# Altium project MY26 HV Inverter Logic Board.PrjPcb (part 2 of 3)

## Sheet Connector.SchDoc
size A; SheetNumber: 6; SheetTotal: 15
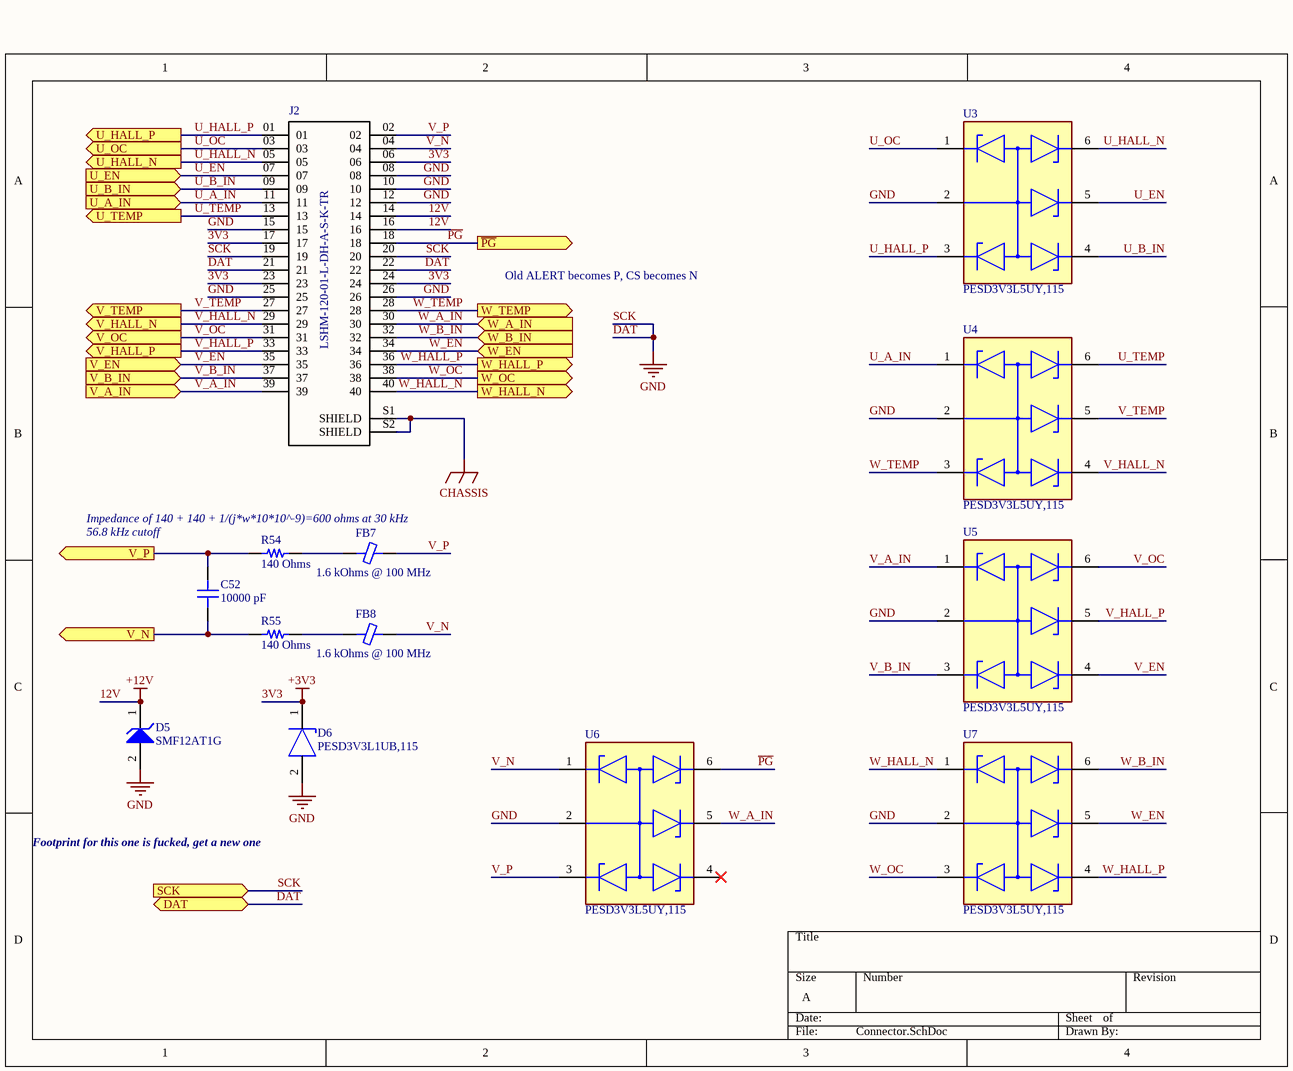
[diagram p4: Connector.SchDoc]

### Parts
C52  10000 pF  [CAP 0402_1005]
D5  SMF12AT1G  [ONSC-SOD-123FL-2-498_V]
D6  PESD3V3L1UB,115  [FP-SOD523-MFG]
FB7  1.6 kOhms @ 100 MHz  [FER 0603_1608]
FB8  1.6 kOhms @ 100 MHz  [FER 0603_1608]
J2  LSHM-120-01-L-DH-A-S-K-TR  [*SAMTEC_LSHM-120-01-L-DH-A-S-K-TR_LSHM-120-01-L-DH-A-S-K-TR(Primary)]
R54  140 Ohms  [RES 0402_1005]
R55  140 Ohms  [RES 0402_1005]
U3  PESD3V3L5UY,115  [FP-SOT363-IPC_A]
U4  PESD3V3L5UY,115  [FP-SOT363-IPC_A]
U5  PESD3V3L5UY,115  [FP-SOT363-IPC_A]
U6  PESD3V3L5UY,115  [FP-SOT363-IPC_A]
U7  PESD3V3L5UY,115  [FP-SOT363-IPC_A]

### Ports
DAT (bidir), SCK (in), U_A_IN (in), U_B_IN (in), U_EN (in), U_HALL_N (out), U_HALL_P (out), U_OC (out), U_TEMP (out), V_A_IN (in), V_B_IN (in), V_EN (in), V_HALL_N (out), V_HALL_P (out), V_N (out), V_OC (out), V_P (out), V_TEMP (out), W_A_IN (in), W_B_IN (in), W_EN (in), W_HALL_N (out), W_HALL_P (out), W_OC (out), W_TEMP (out), ~{PG} (out)

### Nets
+3V3: D6.1(C) J2.06 J2.17 J2.23 J2.24  [also labelled 3V3]
+12V: D5.1(K) J2.14 J2.16  [also labelled 12V]
CHASSIS: J2.S1(SHIELD) J2.S2(SHIELD)
GND: D5.2(A) D6.2(A) J2.08 J2.10 J2.12 J2.15 J2.19 J2.20 J2.21 J2.22 J2.25 J2.26 U3.2(COMMON_ANODE) U4.2(COMMON_ANODE) U5.2(COMMON_ANODE) U6.2(COMMON_ANODE) U7.2(COMMON_ANODE) ; port SCK, port DAT  [also labelled DAT, SCK]
~{PG}: J2.18 U6.6(CATHODE(DIODE_5)) ; port ~{PG}
U_A_IN: J2.11 U4.1(CATHODE(DIODE_1)) ; port U_A_IN
U_B_IN: J2.09 U3.4(CATHODE(DIODE_3)) ; port U_B_IN
U_EN: J2.07 J2.34 J2.35 U3.5(CATHODE(DIODE_4)) U5.4(CATHODE(DIODE_3)) U7.5(CATHODE(DIODE_4)) ; port U_EN, port V_EN, port W_EN  [also labelled V_EN, W_EN]
U_HALL_N: J2.05 U3.6(CATHODE(DIODE_5)) ; port U_HALL_N
U_HALL_P: J2.01 U3.3(CATHODE(DIODE_2)) ; port U_HALL_P
U_OC: J2.03 U3.1(CATHODE(DIODE_1)) ; port U_OC
U_TEMP: J2.13 U4.6(CATHODE(DIODE_5)) ; port U_TEMP
V_A_IN: J2.39 U5.1(CATHODE(DIODE_1)) ; port V_A_IN
V_B_IN: J2.37 U5.3(CATHODE(DIODE_2)) ; port V_B_IN
V_HALL_N: J2.29 U4.4(CATHODE(DIODE_3)) ; port V_HALL_N
V_HALL_P: J2.33 U5.5(CATHODE(DIODE_4)) ; port V_HALL_P
V_N: FB8.2 J2.04 U6.1(CATHODE(DIODE_1))  [project net V_N_6]
V_OC: J2.31 U5.6(CATHODE(DIODE_5)) ; port V_OC
V_P: FB7.2 J2.02 U6.3(CATHODE(DIODE_2))  [project net V_P_6]
V_SENSE_N: C52.1 R55.1 ; port V_N
V_SENSE_P: C52.2 R54.1 ; port V_P
V_TEMP: J2.27 U4.5(CATHODE(DIODE_4)) ; port V_TEMP
W_A_IN: J2.30 U6.5(CATHODE(DIODE_4)) ; port W_A_IN
W_B_IN: J2.32 U7.6(CATHODE(DIODE_5)) ; port W_B_IN
W_HALL_N: J2.40 U7.1(CATHODE(DIODE_1)) ; port W_HALL_N
W_HALL_P: J2.36 U7.4(CATHODE(DIODE_3)) ; port W_HALL_P
W_OC: J2.38 U7.3(CATHODE(DIODE_2)) ; port W_OC
W_TEMP: J2.28 U4.3(CATHODE(DIODE_2)) ; port W_TEMP
NetFB7_1: FB7.1 R54.2
NetFB8_1: FB8.1 R55.2

Not connected (* = marked no-connect by the designer): U6 4(CATHODE(DIODE_3))*

### Notes on the sheet
- Old ALERT becomes P, CS becomes N
- (near C52) 56.8 kHz cutoff
- Impedance of 140 + 140 + 1/(j*w*10*10^-9)=600 ohms at 30 kHz
- Footprint for this one is fucked, get a new one

### Library data of the parts
C52 = C0402C103J5RECAUTO: CAP CER 0402 10NF 50V X7R 5%; manufacturer: KEMET; Part Number: C0402C103J5RECAUTO; Capacitance: 10000 pF; Applications: Automotive, ESD Protection; componentlink1description: Datasheet; componentlink1url: https://api.kemet.com/component-edge/download/datasheet/C0402C103J5RECAUTO.pdf; componentlink2description: DigiKey Link; componentlink2url: https://www.digikey.com/en/products/detail/kemet/C0402C103J5RECAUTO/8646448; Device Package: 0402 (1005 Metric); lastupdated: 2/9/2024 8:04:13 PM; Lifecycle Status: Active; Minimum Order: 1; Mounting Type: Surface Mount, MLCC; Operating Temperature: -55°C ~ 125°C; Package / Case: 0402 (1005 Metric); packaging: TapeAndReel; partid: 33153; Part Status: Active; price: 0.02; Ratings: AEC-Q200; series: ESD SMD Auto X7R; Size / Dimension: 0.039" L x 0.020" W (1.00mm x 0.50mm); Supplier 1: DigiKey; Supplier Part Number 1: 399-C0402C103J5RECAUTOCT-ND; Temperature Coefficient: X7R; Thickness (Max): 0.022" (0.55mm); Tolerance: ±5%; value: 10000 pF; Voltage - Rated: 50V
D5 = CMP-1061-00626-1: 200 W Transient Voltage Suppressor, 2-Pin SOD-123FL, Pb-Free, Tape and Reel; Manufacturer: On Semiconductor; Direction: Unidirectional; V(BR) Typ (V): 14; IR Max (uA): 2.5; PackageDescription: 2-Pin SOD, Body 1.65 x 2.7 mm; ComponentLink2URL: http://www.onsemi.com/pub_link/Collateral/SMF5.0AT1-D.PDF; DatasheetVersion: Rev. 7; PartNumber: SMF12AT1G; ComponentLink1Description: Manufacturer URL; ComponentLink2Description: Datasheet; ComponentLink1URL: http://www.onsemi.com/; ComponentLink3Description: Package Specification; Mounting Technology: Surface Mount; PackageReference: SOD-123FL-2-498; RoHS: Pb-Free; PackageVersion: Rev. D, 05/2013; Packing: Tape and Reel; ComponentLink3URL: http://www.onsemi.com/pub_link/Collateral/498-01.PDF
D6 = CMP-14432-000009-1: TVS DIODE 3.3VWM 11VC SOD523; RoHS Compliant: Yes
FB7 FB8 = MHF1608BAC352ATD25: FERRITE BEAD 1.6K OHM 0603 1LN; Manufacturer: TDK Corporation; Current Rating (Max): 170mA; DC Resistance (DCR) (Max): 1.8Ohm; Number of Lines: 1; Part Number: MHF1608BAC352ATD25; ComponentLink1Description: Datasheet; ComponentLink1URL: https://media.digikey.com/pdf/Data%20Sheets/TDK%20PDFs/MHF1608_Type_DS.pdf; ComponentLink2Description: DigiKey Link; ComponentLink2URL: https://www.digikey.com/en/products/detail/tdk-corporation/MHF1608BAC352ATD25/12702586; Device Package: 0603 (1608 Metric); Height (Max): 0.037" (0.95mm); Impedance @ Frequency: 1.6 kOhms @ 100 MHz; LastUpdated: 6/3/2024 7:51:46 PM; Lifecycle Status: Active; Minimum Order: 1; Mounting Type: Surface Mount; Operating Temperature: -55°C ~ 125°C; Package / Case: 0603 (1608 Metric); Packaging: TapeAndReel; PartId: 2238; Part Status: Active; Price: 0.05; Ratings: AEC-Q200; Series: MHF; Size / Dimension: 0.063" L x 0.031" W (1.60mm x 0.80mm); Supplier 1: DigiKey; Supplier Part Number 1: 445-MHF1608BAC352ATD25CT-ND; Value: 1.6 kOhms @ 100 MHz
R54 R55 = RQ73C1E140RBTD: RES 140 OHMS 0.1% 1/16W 0402; Manufacturer: TE Connectivity Passive Product; Power (Watts): 0.063W, 1/16W; Temperature Coefficient: ±10ppm/°C; Part Number: RQ73C1E140RBTD; Value: 140 Ohms; ComponentLink1Description: Datasheet; ComponentLink1URL: //media.digikey.com/pdf/Data%20Sheets/Tyco%20Electronics%20P%20B%20PDFs/RQ73-0618%20v2.pdf; ComponentLink2Description: DigiKey Link; ComponentLink2URL: https://www.digikey.com/en/products/detail/te-connectivity-passive-product/RQ73C1E140RBTD/9480200; Composition: Thin Film; Device Package: 0402 (1005 Metric); Features: Anti-Sulfur, Automotive AEC-Q200; Height - Seated (Max): 0.016" (0.40mm); LastUpdated: 2/9/2024 8:30:21 PM; Lifecycle Status: Active; Minimum Order: 1; Number of Terminations: 2; Operating Temperature: -55°C ~ 155°C; Package / Case: 0402 (1005 Metric); Packaging: TapeAndReel; PartId: 3032; Part Status: Active; Price: 0.27; Ratings: AEC-Q200; Resistance: 140 Ohms; Series: RQ73; Size / Dimension: 0.039" L x 0.020" W (1.00mm x 0.50mm); Supplier 1: DigiKey; Supplier Part Number 1: A140252CT-ND; Supplier Device Package: 0402; Tolerance: ±0.1%
U3-U7 = CMP-14432-000006-1: TVS DIODE 3.3VWM 12VC 6TSSOP; RoHS Compliant: Yes
J2 = LSHM-120-01-L-DH-A-S-K-TR: Value: *

## Sheet SDMMC.SchDoc
size A; SheetNumber: 7; SheetTotal: 15
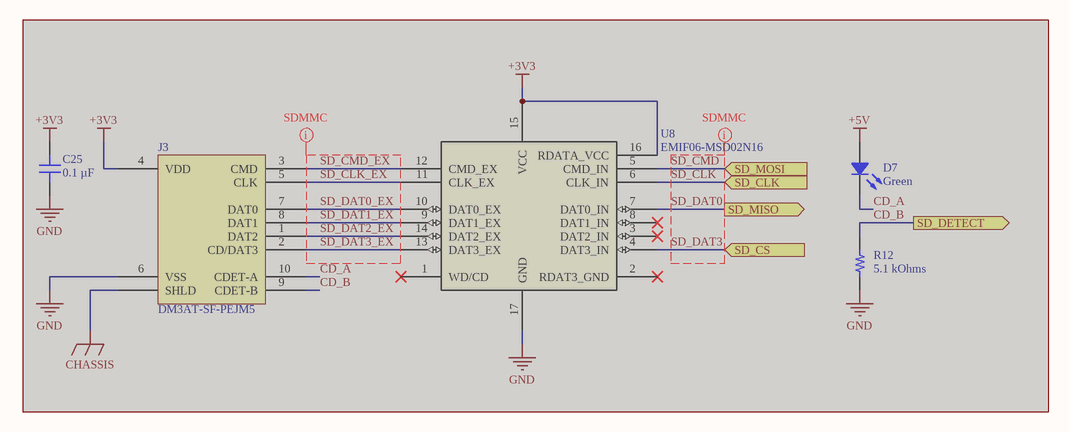
[diagram p5: SDMMC.SchDoc]

### Parts
(Parts that share a designator on the sheet are numbered #1, #2 ... from top to bottom, then left to right.)
C25#2  0.1 µF  [CAP 0402_1005]  (masked out: inside a compile mask, not in the netlist)
D7  Green  [LED 0603_1608 GREEN]  (masked out: inside a compile mask, not in the netlist)
J3#2  DM3AT-SF-PEJM5  [HIROSE DM3AT-SF-PEJM5]  (masked out: inside a compile mask, not in the netlist)
R12#2  5.1 kOhms  [RES 0603_1608]  (masked out: inside a compile mask, not in the netlist)
U8  EMIF06-MSD02N16  [EMIF06MSD02N16]  (masked out: inside a compile mask, not in the netlist)

### Ports
SD_CLK (in), SD_CS (in), SD_DETECT (out), SD_MISO (out), SD_MOSI (in)

### Layout directives
net class SDMMC: SD_CLK, SD_CLK_EX, SD_CMD, SD_CMD_EX, SD_DAT0, SD_DAT0_EX, SD_DAT1_EX, SD_DAT2_EX, SD_DAT3, SD_DAT3_EX

### Library data of the parts
C25#2 = C0402C104K4RECAUTO: CAP CER 0402 0.1UF 16V X7R 10%; manufacturer: KEMET; Part Number: C0402C104K4RECAUTO; Capacitance: 0.1 µF; Applications: Automotive, ESD Protection; componentlink1description: Datasheet; componentlink1url: https://api.kemet.com/component-edge/download/datasheet/C0402C104K4RECAUTO.pdf; componentlink2description: DigiKey Link; componentlink2url: https://www.digikey.com/en/products/detail/kemet/C0402C104K4RECAUTO/8563695; Device Package: 0402 (1005 Metric); lastupdated: 2/9/2024 8:04:38 PM; Lifecycle Status: Active; Minimum Order: 1; Mounting Type: Surface Mount, MLCC; Operating Temperature: -55°C ~ 125°C; Package / Case: 0402 (1005 Metric); packaging: TapeAndReel; partid: 1731; Part Status: Active; price: 0.01; Ratings: AEC-Q200; series: ESD SMD Auto X7R; Size / Dimension: 0.039" L x 0.020" W (1.00mm x 0.50mm); Supplier 1: DigiKey; Supplier Part Number 1: 399-17167-1-ND; Temperature Coefficient: X7R; Thickness (Max): 0.022" (0.55mm); Tolerance: ±10%; value: 0.1 µF; Voltage - Rated: 16V
D7 = SECU1413C-TG20: GREEN, D=564NM, IV=75MCD; Manufacturer: Sanken; Current - Test: 20mA; Lens Size: 0.92mm Dia; Lens Style: Round with Domed Top; Millicandela Rating: 75mcd; Viewing Angle: 60°; Voltage - Forward (Vf) (Typ): 2.1V; Wavelength - Dominant: 564nm; Part Number: SECU1413C-TG20; Color: Green; ComponentLink1Description: Datasheet; ComponentLink1URL: https://www.semicon.sanken-ele.co.jp/sk_content/secu1413c-tg20_ds_en.pdf; ComponentLink2Description: DigiKey Link; ComponentLink2URL: https://www.digikey.com/en/products/detail/sanken/SECU1413C-TG20/16639358; Device Package: 0603 (1608 Metric); Height (Max): 1.48mm; LastUpdated: 6/3/2024 7:58:48 PM; Lifecycle Status: Active; Minimum Order: 1; Mounting Type: Surface Mount; Package / Case: 0603 (1608 Metric); Packaging: CutTape; PartId: 1166; Part Status: Active; Price: 0.28; Series: -; Size / Dimension: 1.60mm L x 0.80mm W; Supplier 1: DigiKey; Supplier Part Number 1: 1261-SECU1413C-TG20TR-ND; Supplier Device Package: 0603; Value: Green
J3#2 = DM3AT-SF-PEJM5: CONN MICRO SD CARD PUSH-PUSH R/A; Manufacturer: Hirose Electric Co Ltd; Card Type: Secure Digital - microSD™; Connector Type: Connector and Ejector; Insertion, Removal Method: Push In, Push Out; Number of Positions: 10 (8 + 2); Part Number: DM3AT-SF-PEJM5; ComponentLink1Description: Datasheet; ComponentLink1URL: https://www.hirose.com/product/document?clcode=CL0609-0033-6-00&productname=DM3AT-SF-PEJ2M5&series=DM3&documenttype=Catalog&lang=en&documentid=D49662_en; ComponentLink2Description: DigiKey Link; ComponentLink2URL: //digikey.com/product-detail/en/hirose-electric-co-ltd/DM3AT-SF-PEJM5/HR1964TR-ND/2533565; Contact Finish: Gold; Features: Switch; Height Above Board: 0.066" (1.68mm); LastUpdated: 12/16/2019 8:34:40 PM; Lifecycle Status: 0; Minimum Order: 1; Mounting Feature: Normal, Standard - Top; Mounting Type: Surface Mount, Right Angle; Packaging: TapeAndReel; Part Status: Active; Price: 1.41; Series: DM3; Supplier 1: DigiKey; Supplier Part Number 1: HR1964TR-ND
R12#2 = RMCF0603JG5K10: RES 5.1K OHM 5% 1/10W 0603; Manufacturer: Stackpole Electronics Inc; Power (Watts): 0.1W, 1/10W; Temperature Coefficient: ±200ppm/°C; Part Number: RMCF0603JG5K10; Value: 5.1 kOhms; ComponentLink1Description: Datasheet; ComponentLink1URL: https://www.seielect.com/catalog/sei-packaging.pdf; ComponentLink2Description: DigiKey Link; ComponentLink2URL: https://www.digikey.com/en/products/detail/stackpole-electronics-inc/RMCF0603JG5K10/1712287; Composition: Thick Film; Device Package: 0603 (1608 Metric); Features: Automotive AEC-Q200; Height - Seated (Max): 0.022" (0.55mm); LastUpdated: 2/9/2024 8:43:35 PM; Lifecycle Status: Active; Minimum Order: 1; Number of Terminations: 2; Operating Temperature: -55°C ~ 155°C; Package / Case: 0603 (1608 Metric); Packaging: CutTape; PartId: 5180; Part Status: Active; Price: 0.01; Ratings: AEC-Q200; Resistance: 5.1 kOhms; Series: RMCF; Size / Dimension: 0.061" L x 0.031" W (1.55mm x 0.80mm); Supplier 1: DigiKey; Supplier Part Number 1: 738-RMCF0603JG5K10CT-ND; Supplier Device Package: 0603; Tolerance: ±5%
U8 = EMIF06-MSD02N16: No Description Available; Mfr_Name: STMicroelectronics; RefDes: RefDes; Type: Type

## Sheet Power.SchDoc
size A; SheetNumber: 8; SheetTotal: 15
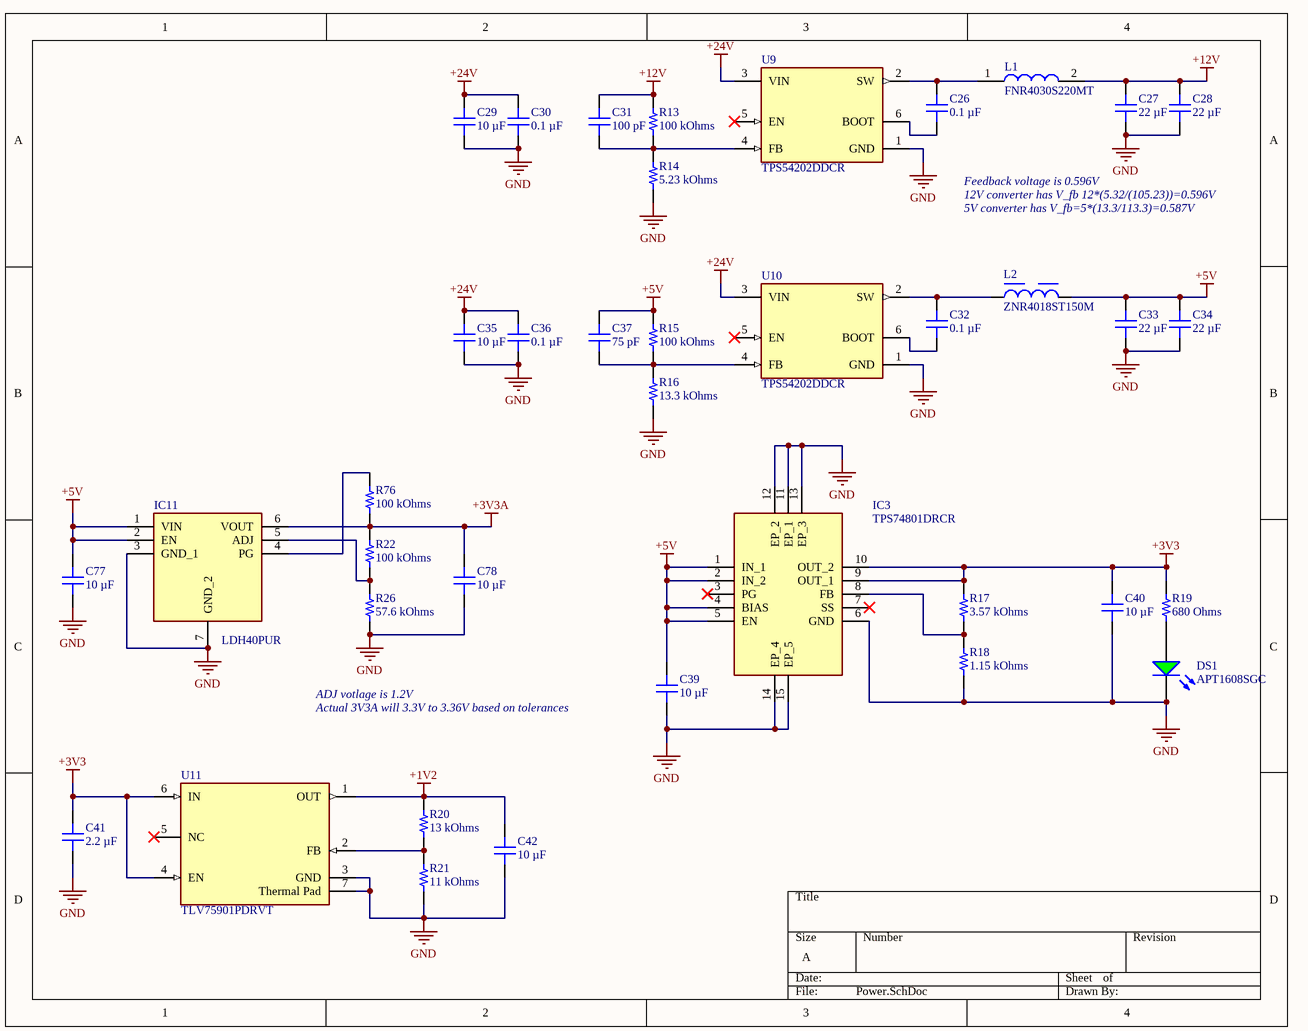
[diagram p6: Power.SchDoc]

### Parts
(Parts that share a designator on the sheet are numbered #1, #2 ... from top to bottom, then left to right.)
C26  0.1 µF  [MURATA GCM155 0402_1005]
C27  22 µF  [CAP 0805_2012]
C28  22 µF  [CAP 0805_2012]
C29  10 µF  [CAP 0805_2012]
C30  0.1 µF  [CAP 0402_1005]
C31  100 pF  [CAP 0402_1005]
C32  0.1 µF  [MURATA GCM155 0402_1005]
C33  22 µF  [CAP 0805_2012]
C34  22 µF  [CAP 0805_2012]
C35  10 µF  [CAP 0805_2012]
C36  0.1 µF  [CAP 0402_1005]
C37  75 pF  [MURATA GCM155 0402_1005]
C39  10 µF  [CAP 0402_1005]
C40  10 µF  [CAP 0402_1005]
C41  2.2 µF  [CAP 0402_1005]
C42  10 µF  [CAP 0402_1005]
C77  10 µF  [CAP 0402_1005]
C78  10 µF  [CAP 0402_1005]
DS1  APT1608SGC  [KING-APT1608SGC_V]
IC3  TPS74801DRCR  [TPS74801DRCR]
IC11  LDH40PUR  [SON65P200X200X80-7N]
L1  FNR4030S220MT  [VLCF4020]
L2  ZNR4018ST150M  [WE-LQS_4025]
R13  100 kOhms  [RES 0402_1005]
R14  5.23 kOhms  [RES 0402_1005]
R15  100 kOhms  [RES 0402_1005]
R16  13.3 kOhms  [YAGEO RES 0402_1005]
R17  3.57 kOhms  [YAGEO RES 0402_1005]
R18  1.15 kOhms  [RES 0402_1005]
R19  680 Ohms  [YAGEO RES 0402_1005]
R20  13 kOhms  [YAGEO RES 0402_1005]
R21  11 kOhms  [RES 0402_1005]
R22  100 kOhms  [RES 0402_1005]
R26#1  57.6 kOhms  [RES 0402_1005]
R76  100 kOhms  [RES 0402_1005]
U9  TPS54202DDCR  [FP-DDC0006A-IPC_B]
U10  TPS54202DDCR  [FP-DDC0006A-IPC_B]
U11  TLV75901PDRVT  [FP-DRV0006A-IPC_B]

### Nets
+1V2: C42.2 R20.2 U11.1(OUT)
+3V3: C40.2 C41.2 IC3.9(OUT_1) IC3.10(OUT_2) R17.2 R19.2 U11.4(EN) U11.6(IN)
+3V3A: C78.2 IC11.6(VOUT) R22.2 R76.1
+5V: C33.2 C34.2 C37.2 C39.2 C77.2 IC3.1(IN_1) IC3.2(IN_2) IC3.4(BIAS) IC3.5(EN) IC11.1(VIN) IC11.2(EN) L2.2 R15.2
+12V: C27.2 C28.2 C31.2 L1.2 R13.2
+24V: C29.2 C30.2 C35.2 C36.2 U9.3(VIN) U10.3(VIN)
GND: C27.1 C28.1 C29.1 C30.1 C33.1 C34.1 C35.1 C36.1 C39.1 C40.1 C41.1 C42.1 C77.1 C78.1 DS1.2(K) IC3.6(GND) IC3.11(EP_1) IC3.12(EP_2) IC3.13(EP_3) IC3.14(EP_4) IC3.15(EP_5) IC11.3(GND_1) IC11.7(GND_2) R14.1 R16.1 R18.1 R21.1 R26#1.1 U9.1(GND) U10.1(GND) U11.3(GND) U11.7(Thermal_Pad)
NetC26_1: C26.1 U9.6(BOOT)
NetC26_2: C26.2 L1.1 U9.2(SW)
NetC31_1: C31.1 R13.1 R14.2 U9.4(FB)
NetC32_1: C32.1 U10.6(BOOT)
NetC32_2: C32.2 L2.1 U10.2(SW)
NetC37_1: C37.1 R15.1 R16.2 U10.4(FB)
NetDS1_1: DS1.1(A) R19.1
NetIC3_8: IC3.8(FB) R17.1 R18.2
NetIC11_4: IC11.4(PG) R76.2
NetIC11_5: IC11.5(ADJ) R22.1 R26#1.2
NetR20_1: R20.1 R21.2 U11.2(FB)

Not connected (* = marked no-connect by the designer): IC3 3(PG)* 7(SS)*; U9 5(EN)*; U10 5(EN)*; U11 5(NC)*

### Notes on the sheet
- Feedback voltage is 0.596V
- 12V converter has V_fb 12*(5.32/(105.23))=0.596V
- 5V converter has V_fb=5*(13.3/113.3)=0.587V
- ADJ votlage is 1.2V
- (near C39) Actual 3V3A will 3.3V to 3.36V based on tolerances

### Library data of the parts
C26 C32 = GCM155R71E104KE02D: CAP CER 0.1UF 25V X7R 0402; manufacturer: Murata Electronics; Tolerance: ±10%; Part Number: GCM155R71E104KE02D; Capacitance: 0.1 µF; Applications: Automotive; componentlink1description: Datasheet; componentlink1url: https://search.murata.co.jp/Ceramy/image/img/A01X/G101/ENG/GCM155R71E104KE02-01.pdf; componentlink2description: DigiKey Link; componentlink2url: https://www.digikey.com/en/products/detail/murata-electronics/GCM155R71E104KE02D/7363175; Device Package: 0402 (1005 Metric); lastupdated: 7/20/2024 2:04:19 AM; Lifecycle Status: Active; Minimum Order: 1; Mounting Type: Surface Mount, MLCC; Operating Temperature: -55°C ~ 125°C; Package / Case: 0402 (1005 Metric); packaging: TapeAndReel; partid: 2051; Part Status: Active; price: 0.01; Ratings: AEC-Q200; series: GCM; Size / Dimension: 0.039" L x 0.020" W (1.00mm x 0.50mm); Supplier 1: DigiKey; Supplier Part Number 1: 490-16431-1-ND; Temperature Coefficient: X7R; Thickness (Max): 0.022" (0.55mm); value: 0.1 µF; Voltage - Rated: 25V
C27 C28 C33 C34 = CL21A226MAYNNNE: CAP CER 22UF 25V X5R 0805; manufacturer: Samsung Electro-Mechanics; Tolerance: ±20%; Part Number: CL21A226MAYNNNE; Capacitance: 22 µF; Applications: General Purpose; componentlink1description: Datasheet; componentlink1url: https://media.digikey.com/pdf/Data%20Sheets/Samsung%20PDFs/CL21A226MAYNNNE_Spec.pdf; componentlink2description: DigiKey Link; componentlink2url: https://www.digikey.com/en/products/detail/samsung-electro-mechanics/CL21A226MAYNNNE/10479857; Device Package: 0805 (2012 Metric); lastupdated: 2/9/2024 8:15:02 PM; Lifecycle Status: Active; Minimum Order: 1; Mounting Type: Surface Mount, MLCC; Operating Temperature: -55°C ~ 85°C; Package / Case: 0805 (2012 Metric); packaging: TapeAndReel; partid: 39209; Part Status: Active; price: 0.04; series: CL; Size / Dimension: 0.079" L x 0.049" W (2.00mm x 1.25mm); Supplier 1: DigiKey; Supplier Part Number 1: 1276-CL21A226MAYNNNECT-ND; Temperature Coefficient: X5R; Thickness (Max): 0.057" (1.45mm); value: 22 µF; Voltage - Rated: 25V
C29 C35 = C0805B106K050T: CAP CER 10UF 50V X5R 0805; manufacturer: Holy Stone Enterprise Co., Ltd.; Tolerance: ±10%; Part Number: C0805B106K050T; Capacitance: 10 µF; Applications: General Purpose; componentlink1description: Datasheet; componentlink1url: https://media.digikey.com/pdf/Data%20Sheets/Holy%20Stone/NCC_Series_DS.pdf; componentlink2description: DigiKey Link; componentlink2url: https://www.digikey.com/en/products/detail/holy-stone-enterprise-co-ltd/C0805B106K050T/16894957; Device Package: 0805 (2012 Metric); lastupdated: 2/9/2024 8:14:45 PM; Lifecycle Status: Active; Minimum Order: 1; Mounting Type: Surface Mount, MLCC; Operating Temperature: -55°C ~ 85°C; Package / Case: 0805 (2012 Metric); packaging: TapeAndReel; partid: 48876; Part Status: Active; price: 0.11; series: NCC; Size / Dimension: 0.079" L x 0.049" W (2.00mm x 1.25mm); Supplier 1: DigiKey; Supplier Part Number 1: 4587-C0805B106K050TCT-ND; Temperature Coefficient: X5R; value: 10 µF; Voltage - Rated: 50V
C30 C36 = CGA2B3X5R1H104M050BB: CAP CER 0.1UF 50V X5R 0402; manufacturer: TDK Corporation; Tolerance: ±20%; Part Number: CGA2B3X5R1H104M050BB; Capacitance: 0.1 µF; Applications: Automotive; componentlink1description: Datasheet; componentlink1url: https://product.tdk.com/info/en/catalog/datasheets/mlcc_automotive_general_en.pdf?ref_disty=digikey; componentlink2description: DigiKey Link; componentlink2url: https://www.digikey.com/en/products/detail/tdk-corporation/CGA2B3X5R1H104M050BB/3949450; Device Package: 0402 (1005 Metric); lastupdated: 2/9/2024 8:04:38 PM; Lifecycle Status: Active; Minimum Order: 1; Mounting Type: Surface Mount, MLCC; Operating Temperature: -55°C ~ 85°C; Package / Case: 0402 (1005 Metric); packaging: TapeAndReel; partid: 1792; Part Status: Active; price: 0.01; Ratings: AEC-Q200; series: CGA; Size / Dimension: 0.039" L x 0.020" W (1.00mm x 0.50mm); Supplier 1: DigiKey; Supplier Part Number 1: 445-12214-1-ND; Temperature Coefficient: X5R; Thickness (Max): 0.022" (0.55mm); value: 0.1 µF; Voltage - Rated: 50V
C31 = 500X07N101MV4T: CAP CER 100PF 50V C0G/NP0 0402; manufacturer: Johanson Dielectrics Inc.; Temperature Coefficient: C0G, NP0; Tolerance: ±20%; Part Number: 500X07N101MV4T; Capacitance: 100 pF; Applications: Bypass, Decoupling; componentlink1description: Datasheet; componentlink1url: https://www.johansondielectrics.com/downloads/x2y-filter-and-decoupling-capacitors.pdf; componentlink2description: DigiKey Link; componentlink2url: https://www.digikey.com/en/products/detail/johanson-dielectrics-inc/500X07N101MV4T/2046917; Device Package: 0402 (1005 Metric); Features: Low ESL (X2Y); lastupdated: 2/9/2024 8:04:38 PM; Lifecycle Status: Active; Minimum Order: 1; Mounting Type: Surface Mount, MLCC; Operating Temperature: -55°C ~ 125°C; Package / Case: 0402 (1005 Metric); packaging: TapeAndReel; partid: 1767; Part Status: Active; price: 0.08; series: X2Y®; Size / Dimension: 0.045" L x 0.025" W (1.14mm x 0.64mm); Supplier 1: DigiKey; Supplier Part Number 1: 709-1214-1-ND; Thickness (Max): 0.020" (0.51mm); value: 100 pF; Voltage - Rated: 50V
C37 = GCM1555C1H750FA16D: CAP CER 75PF 50V C0G/NP0 0402; manufacturer: Murata Electronics; Temperature Coefficient: C0G, NP0; Tolerance: ±1%; Part Number: GCM1555C1H750FA16D; Capacitance: 75 pF; Applications: Automotive; componentlink1description: Datasheet; componentlink1url: https://search.murata.co.jp/Ceramy/image/img/A01X/G101/ENG/GCM1555C1H750FA16-01.pdf; componentlink2description: DigiKey Link; componentlink2url: https://www.digikey.com/en/products/detail/murata-electronics/GCM1555C1H750FA16D/7362941; Device Package: 0402 (1005 Metric); lastupdated: 7/20/2024 2:04:17 AM; Lifecycle Status: Active; Minimum Order: 1; Mounting Type: Surface Mount, MLCC; Operating Temperature: -55°C ~ 125°C; Package / Case: 0402 (1005 Metric); packaging: TapeAndReel; partid: 32579; Part Status: Active; price: 0.01; Ratings: AEC-Q200; series: GCM; Size / Dimension: 0.039" L x 0.020" W (1.00mm x 0.50mm); Supplier 1: DigiKey; Supplier Part Number 1: 490-GCM1555C1H750FA16DCT-ND; Thickness (Max): 0.022" (0.55mm); value: 75 pF; Voltage - Rated: 50V
C39 C40 C42 C77 C78 = CL05A106MP8NUB8: CAP CER 10UF 10V X5R 0402; manufacturer: Samsung Electro-Mechanics; Tolerance: ±20%; Part Number: CL05A106MP8NUB8; Capacitance: 10 µF; Applications: Acoustic Noise Reduction; componentlink1description: Datasheet; componentlink1url: http://www.samsungsem.com/kr/support/product-search/mlcc/CL05A106MP8NUB8.jsp; componentlink2description: DigiKey Link; componentlink2url: https://www.digikey.com/en/products/detail/samsung-electro-mechanics/CL05A106MP8NUB8/5961314; Device Package: 0402 (1005 Metric); lastupdated: 2/9/2024 8:04:38 PM; Lifecycle Status: Active; Minimum Order: 1; Mounting Type: Surface Mount, MLCC; Operating Temperature: -55°C ~ 85°C; Package / Case: 0402 (1005 Metric); packaging: TapeAndReel; partid: 1758; Part Status: Active; price: 0.06; series: CL; Size / Dimension: 0.039" L x 0.020" W (1.00mm x 0.50mm); Supplier 1: DigiKey; Supplier Part Number 1: 1276-6830-1-ND; Temperature Coefficient: X5R; Thickness (Max): 0.035" (0.90mm); value: 10 µF; Voltage - Rated: 10V
C41 = CL05A225KO5NQNC: CAP CER 2.2UF 16V X5R 0402; manufacturer: Samsung Electro-Mechanics; Tolerance: ±10%; Part Number: CL05A225KO5NQNC; Capacitance: 2.2 µF; Applications: General Purpose; componentlink1description: Datasheet; componentlink1url: http://www.samsungsem.com/kr/support/product-search/mlcc/CL05A225KO5NQNC.jsp; componentlink2description: DigiKey Link; componentlink2url: https://www.digikey.com/en/products/detail/samsung-electro-mechanics/CL05A225KO5NQNC/3887119; Device Package: 0402 (1005 Metric); lastupdated: 2/9/2024 8:04:38 PM; Lifecycle Status: Active; Minimum Order: 1; Mounting Type: Surface Mount, MLCC; Operating Temperature: -55°C ~ 85°C; Package / Case: 0402 (1005 Metric); packaging: TapeAndReel; partid: 1761; Part Status: Active; price: 0.03; series: CL; Size / Dimension: 0.039" L x 0.020" W (1.00mm x 0.50mm); Supplier 1: DigiKey; Supplier Part Number 1: 1276-1461-1-ND; Temperature Coefficient: X5R; Thickness (Max): 0.022" (0.55mm); value: 2.2 µF; Voltage - Rated: 16V
DS1 = CMP-2000-05789-1: Super Bright Green LED, 62.5 mW, 25 mA, -40 to 85 degC, 2-Pin SMD, RoHS, Tape and Reel; Manufacturer: Kingbright; Online Catalog: 0603RectanglewithFlatTopChipLEDs; Wavelength - Dominant: 568nm; Wavelength - Peak: 565nm; Voltage - Forward (Vf) (Typ): 2.2V; Lens Type: Clear; Other Names: 754-1121-2; Millicandela Rating: 15mcd; Catalog Drawings: APT1608SeriesTop / APT1608SeriesSide; Lens Style/Size: RectanglewithFlatTop,1.2mmx0.8mm; Current - Test: 20mA; 3D Model: APT1608x.sldprt / APT1608x.pro / APT1608x.igs / APT1608x.stp; Viewing Angle: 120°; Package / Case: 0603(1608Metric); Category: Optoelectronics; Package Description: 2-Pin Surface Mount Device, Body 0.8 x 1.6 mm; Mounting Type: SurfaceMount; Color: Green; Height: 0.75mm; Datasheet Version: Rev. 16B, 02/2012; Family: LEDIndication-Discrete; Manufacturer URL: http://www.kingbright.com/; Package Reference: APT1608SGC; Datasheet URL: https://datasheet.ciiva.com/2113/apt1608sgc-2113808.pdf; Mounting Technology: SurfaceMount; Packaging: Tape&Reel(TR); Standard Package: 2,000; Size / Dimension: 1.60mmLx0.80mmW
IC3 = TPS74801DRCR: Integrated Circuit; Manufacturer_Name: Texas Instruments; Datasheet Link: https://www.ti.com/lit/gpn/TPS74801; Height: 1mm; Manufacturer_Part_Number: TPS74801DRCR; Mouser Part Number: 595-TPS74801DRCR; Mouser Price/Stock: https://www.mouser.co.uk/ProductDetail/Texas-Instruments/TPS74801DRCR?qs=MiEMpo83RV6vgm8Iaojmyg%3D%3D; Arrow Part Number: TPS74801DRCR; Arrow Price/Stock: https://www.arrow.com/en/products/tps74801drcr/texas-instruments?region=nac
IC11 = LDH40PUR: Integrated Circuit; Manufacturer_Name: STMicroelectronics; Datasheet Link: https://www.st.com/resource/en/datasheet/ldh40.pdf; Height: 0.8mm; Manufacturer_Part_Number: LDH40PUR
L1 = VLCF4020T-220MR56: 22uH Magnetic Shielded Inductor 1.4A SMD,4x4mm Fixed Inductors RoHS; Manufacturer_Name: TDK; Datasheet Link: https://product.tdk.com/system/files/dam/doc/product/inductor/inductor/smd/catalog/inductor_commercial_power_vlcf4020_en.pdf; Manufacturer_Part_Number: VLCF4020T-220MR56; Mouser Part Number: 810-VLCF4020T220MR56; Mouser Price/Stock: https://www.mouser.co.uk/ProductDetail/TDK/VLCF4020T-220MR56?qs=O2qRfqcg9D8DoR1uKFMlTA%3D%3D; Arrow Part Number: VLCF4020T-220MR56; Arrow Price/Stock: https://www.arrow.com/en/products/vlcf4020t-220mr56/tdk?region=nac
L2 = CMP-03913-77814858-1: FIXED IND 15uH 1A 250mΩ SMD,4x4mm; Current Rating: 1.45A; Inductance: 15µH; Inductance Tolerance: 20%; DC Resistance (DCR): 132mΩ; Max Operating Temperature: 125°C; Ambient Temperature Range High: 85°C; Length: 4mm; Ambient Temperature Range Low: -40°C; RoHS: Compliant; Height: 2.5mm; Min Operating Temperature: -40°C; NexarPartId: 77814858; Width: 4mm
R13 R15 R22 R76 = RP73PF1E100KBTD: RES 100K OHM 0.1% 1/10W 0402; Manufacturer: TE Connectivity Passive Product; Power (Watts): 0.1W, 1/10W; Temperature Coefficient: ±25ppm/°C; Part Number: RP73PF1E100KBTD; Value: 100 kOhms; ComponentLink1Description: Datasheet; ComponentLink1URL: https://www.te.com/commerce/DocumentDelivery/DDEController?Action=srchrtrv&DocNm=1773272&DocType=DS&DocLang=English; ComponentLink2Description: DigiKey Link; ComponentLink2URL: https://www.digikey.com/en/products/detail/te-connectivity-passive-product/RP73PF1E100KBTD/8261053; Composition: Thin Film; Device Package: 0402 (1005 Metric); Height - Seated (Max): 0.014" (0.35mm); LastUpdated: 2/9/2024 8:30:24 PM; Lifecycle Status: Active; Minimum Order: 1; Number of Terminations: 2; Operating Temperature: -55°C ~ 155°C; Package / Case: 0402 (1005 Metric); Packaging: TapeAndReel; PartId: 2436; Part Status: Active; Price: 0.08; Resistance: 100 kOhms; Series: RP73, Holsworthy; Size / Dimension: 0.039" L x 0.020" W (1.00mm x 0.50mm); Supplier 1: DigiKey; Supplier Part Number 1: A127511CT-ND; Supplier Device Package: 0402; Tolerance: ±0.1%
R14 = ERJ-2RKF5231X: RES SMD 5.23K OHM 1% 1/10W 0402; Manufacturer: Panasonic Electronic Components; Power (Watts): 0.1W, 1/10W; Temperature Coefficient: ±100ppm/°C; Part Number: ERJ-2RKF5231X; Value: 5.23 kOhms; ComponentLink1Description: Datasheet; ComponentLink1URL: https://industrial.panasonic.com/cdbs/www-data/pdf/RDA0000/AOA0000C304.pdf; ComponentLink2Description: DigiKey Link; ComponentLink2URL: https://www.digikey.com/en/products/detail/panasonic-electronic-components/ERJ-2RKF5231X/192387; Composition: Thick Film; Device Package: 0402 (1005 Metric); Features: Automotive AEC-Q200; Height - Seated (Max): 0.016" (0.40mm); LastUpdated: 2/9/2024 8:30:18 PM; Lifecycle Status: Active; Minimum Order: 1; Number of Terminations: 2; Operating Temperature: -55°C ~ 155°C; Package / Case: 0402 (1005 Metric); Packaging: CutTape; PartId: 3829; Part Status: Active; Price: 0.01; Ratings: AEC-Q200; Resistance: 5.23 kOhms; Series: ERJ-2RK; Size / Dimension: 0.039" L x 0.020" W (1.00mm x 0.50mm); Supplier 1: DigiKey; Supplier Part Number 1: P5.23KLCT-ND; Supplier Device Package: 0402; Tolerance: ±1%
R16 = RC0402FR-0713K3L: RES 13.3K OHM 1% 1/16W 0402; Manufacturer: Yageo; Power (Watts): 0.063W, 1/16W; Temperature Coefficient: ±100ppm/°C; Part Number: RC0402FR-0713K3L; Value: 13.3 kOhms; ComponentLink1Description: Datasheet; ComponentLink1URL: https://www.yageo.com/upload/media/product/productsearch/datasheet/rchip/PYu-RC_Group_51_RoHS_L_10.pdf; ComponentLink2Description: DigiKey Link; ComponentLink2URL: https://www.digikey.com/en/products/detail/yageo/RC0402FR-0713K3L/5280834; Composition: Thick Film; Device Package: 0402 (1005 Metric); Features: Moisture Resistant; Height - Seated (Max): 0.016" (0.40mm); LastUpdated: 8/31/2025 3:04:18 PM; Lifecycle Status: Active; Minimum Order: 1; Number of Terminations: 2; Operating Temperature: -55°C ~ 155°C; Package / Case: 0402 (1005 Metric); Packaging: CutTape; PartId: 2643; Part Status: Active; Price: 0.01; Resistance: 13.3 kOhms; Series: RC_L; Size / Dimension: 0.039" L x 0.020" W (1.00mm x 0.50mm); Supplier 1: DigiKey; Supplier Part Number 1: YAG2974CT-ND; Supplier Device Package: 0402; Tolerance: ±1%
R17 = RC0402FR-073K57L: RES 3.57K OHM 1% 1/16W 0402; Manufacturer: Yageo; Power (Watts): 0.063W, 1/16W; Temperature Coefficient: ±100ppm/°C; Part Number: RC0402FR-073K57L; Value: 3.57 kOhms; ComponentLink1Description: Datasheet; ComponentLink1URL: https://www.yageo.com/upload/media/product/productsearch/datasheet/rchip/PYu-RC_Group_51_RoHS_L_10.pdf; ComponentLink2Description: DigiKey Link; ComponentLink2URL: https://www.digikey.com/en/products/detail/yageo/RC0402FR-073K57L/5281010; Composition: Thick Film; Device Package: 0402 (1005 Metric); Features: Moisture Resistant; Height - Seated (Max): 0.016" (0.40mm); LastUpdated: 8/31/2025 3:04:18 PM; Lifecycle Status: Active; Minimum Order: 1; Number of Terminations: 2; Operating Temperature: -55°C ~ 155°C; Package / Case: 0402 (1005 Metric); Packaging: CutTape; PartId: 2603; Part Status: Active; Price: 0.01; Resistance: 3.57 kOhms; Series: RC_L; Size / Dimension: 0.039" L x 0.020" W (1.00mm x 0.50mm); Supplier 1: DigiKey; Supplier Part Number 1: YAG3150CT-ND; Supplier Device Package: 0402; Tolerance: ±1%
R18 = TNPW04021K15BYEP: TNPW0402 1K15 0.1% T-13 EP1 E3; Manufacturer: Vishay Dale; Power (Watts): 0.063W, 1/16W; Temperature Coefficient: ±10ppm/°C; Part Number: TNPW04021K15BYEP; Value: 1.15 kOhms; ComponentLink1Description: Datasheet; ComponentLink1URL: https://www.vishay.com/docs/28758/tnpw_e3.pdf; ComponentLink2Description: DigiKey Link; ComponentLink2URL: https://www.digikey.com/en/products/detail/vishay-dale/TNPW04021K15BYEP/18883256; Composition: Thin Film; Device Package: 0402 (1005 Metric); Features: Anti-Sulfur, Automotive AEC-Q200, Moisture Resistant; Height - Seated (Max): 0.016" (0.40mm); LastUpdated: 2/9/2024 8:28:23 PM; Lifecycle Status: Active; Minimum Order: 1; Number of Terminations: 2; Operating Temperature: -55°C ~ 155°C; Package / Case: 0402 (1005 Metric); Packaging: TapeAndReel; PartId: 81440; Price: 0.25; Ratings: AEC-Q200; Resistance: 1.15 kOhms; Series: TNPW e3; Size / Dimension: 0.039" L x 0.020" W (1.00mm x 0.50mm); Supplier 1: DigiKey; Supplier Part Number 1: 541-TNPW04021K15BYEPCT-ND; Supplier Device Package: 0402; Tolerance: ±0.1%
R19 = RC0402FR-07680RL: RES 680 OHM 1% 1/16W 0402; Manufacturer: Yageo; Power (Watts): 0.063W, 1/16W; Temperature Coefficient: ±100ppm/°C; Part Number: RC0402FR-07680RL; Value: 680 Ohms; ComponentLink1Description: Datasheet; ComponentLink1URL: https://www.yageo.com/upload/media/product/productsearch/datasheet/rchip/PYu-RC_Group_51_RoHS_L_10.pdf; ComponentLink2Description: DigiKey Link; ComponentLink2URL: https://www.digikey.com/en/products/detail/yageo/RC0402FR-07680RL/726654; Composition: Thick Film; Device Package: 0402 (1005 Metric); Features: Moisture Resistant; Height - Seated (Max): 0.016" (0.40mm); LastUpdated: 8/31/2025 3:04:18 PM; Lifecycle Status: Active; Minimum Order: 1; Number of Terminations: 2; Operating Temperature: -55°C ~ 155°C; Package / Case: 0402 (1005 Metric); Packaging: CutTape; PartId: 2599; Part Status: Active; Price: 0.01; Resistance: 680 Ohms; Series: RC_L; Size / Dimension: 0.039" L x 0.020" W (1.00mm x 0.50mm); Supplier 1: DigiKey; Supplier Part Number 1: 311-680LRCT-ND; Supplier Device Package: 0402; Tolerance: ±1%
R20 = RC0402FR-0713KL: RES 13K OHM 1% 1/16W 0402; Manufacturer: Yageo; Power (Watts): 0.063W, 1/16W; Temperature Coefficient: ±100ppm/°C; Part Number: RC0402FR-0713KL; Value: 13 kOhms; ComponentLink1Description: Datasheet; ComponentLink1URL: https://www.yageo.com/upload/media/product/productsearch/datasheet/rchip/PYu-RC_Group_51_RoHS_L_10.pdf; ComponentLink2Description: DigiKey Link; ComponentLink2URL: https://www.digikey.com/en/products/detail/yageo/RC0402FR-0713KL/726539; Composition: Thick Film; Device Package: 0402 (1005 Metric); Features: Moisture Resistant; Height - Seated (Max): 0.016" (0.40mm); LastUpdated: 8/31/2025 3:04:18 PM; Lifecycle Status: Active; Minimum Order: 1; Number of Terminations: 2; Operating Temperature: -55°C ~ 155°C; Package / Case: 0402 (1005 Metric); Packaging: CutTape; PartId: 2760; Part Status: Active; Price: 0.01; Resistance: 13 kOhms; Series: RC_L; Size / Dimension: 0.039" L x 0.020" W (1.00mm x 0.50mm); Supplier 1: DigiKey; Supplier Part Number 1: 311-13.0KLRCT-ND; Supplier Device Package: 0402; Tolerance: ±1%
R21 = ERJ-2RKF1102X: RES SMD 11K OHM 1% 1/10W 0402; Manufacturer: Panasonic Electronic Components; Power (Watts): 0.1W, 1/10W; Temperature Coefficient: ±100ppm/°C; Part Number: ERJ-2RKF1102X; Value: 11 kOhms; ComponentLink1Description: Datasheet; ComponentLink1URL: https://industrial.panasonic.com/cdbs/www-data/pdf/RDA0000/AOA0000C304.pdf; ComponentLink2Description: DigiKey Link; ComponentLink2URL: https://www.digikey.com/en/products/detail/panasonic-electronic-components/ERJ-2RKF1102X/192089; Composition: Thick Film; Device Package: 0402 (1005 Metric); Features: Automotive AEC-Q200; Height - Seated (Max): 0.016" (0.40mm); LastUpdated: 2/9/2024 8:30:07 PM; Lifecycle Status: Active; Minimum Order: 1; Number of Terminations: 2; Operating Temperature: -55°C ~ 155°C; Package / Case: 0402 (1005 Metric); Packaging: CutTape; PartId: 6474; Part Status: Active; Price: 0.01; Ratings: AEC-Q200; Resistance: 11 kOhms; Series: ERJ-2RK; Size / Dimension: 0.039" L x 0.020" W (1.00mm x 0.50mm); Supplier 1: DigiKey; Supplier Part Number 1: P11.0KLCT-ND; Supplier Device Package: 0402; Tolerance: ±1%
R26#1 = RMCF0402FT57K6: RES 57.6K OHM 1% 1/16W 0402; Manufacturer: Stackpole Electronics Inc; Power (Watts): 0.063W, 1/16W; Temperature Coefficient: ±100ppm/°C; Part Number: RMCF0402FT57K6; Value: 57.6 kOhms; ComponentLink1Description: Datasheet; ComponentLink1URL: https://www.seielect.com/catalog/sei-rmcf_rmcp.pdf; ComponentLink2Description: DigiKey Link; ComponentLink2URL: https://www.digikey.com/en/products/detail/stackpole-electronics-inc/RMCF0402FT57K6/1761716; Composition: Thick Film; Device Package: 0402 (1005 Metric); Features: Automotive AEC-Q200; Height - Seated (Max): 0.016" (0.40mm); LastUpdated: 2/9/2024 8:30:11 PM; Lifecycle Status: Active; Minimum Order: 1; Number of Terminations: 2; Operating Temperature: -55°C ~ 155°C; Package / Case: 0402 (1005 Metric); Packaging: CutTape; PartId: 5441; Part Status: Active; Price: 0.01; Ratings: AEC-Q200; Resistance: 57.6 kOhms; Series: RMCF; Size / Dimension: 0.039" L x 0.020" W (1.00mm x 0.50mm); Supplier 1: DigiKey; Supplier Part Number 1: RMCF0402FT57K6CT-ND; Supplier Device Package: 0402; Tolerance: ±1%
U9 U10 = CMP-04918-000439-1: IC REG BUCK ADJ 2A TSOT23-6; Switching Frequency: 500kHz; Quiescent Current: 40uA; Max Output Voltage: 28V; Output Configuration: Positive; Min Output Voltage: 596mV; Min Input Voltage: 4.5V; Synchronous Rectifier: Yes; Output Type: Adjustable; Number of Outputs: 1; Packaging: Tape and Reel; Case/Package: SOT-23-6; RoHS Compliant: Yes; Max Input Voltage: 28V; Max Operating Temperature: 125°C; Min Operating Temperature: -40°C; Output Current: 2A; Lead Free: Lead Free; Mount: Surface Mount
U11 = CMP-04917-000114-1: IC REG LINEAR POS ADJ 1A 6WSON; RoHS Compliant: Yes

## Sheet PowerConnector.SchDoc
size A; SheetNumber: 9; SheetTotal: 15
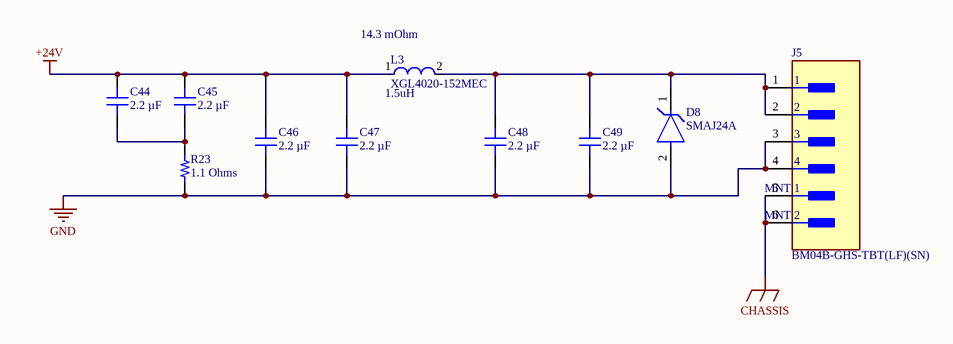
[diagram p7: PowerConnector.SchDoc]

### Parts
C44  2.2 µF  [CAP 0805_2012]
C45  2.2 µF  [CAP 0805_2012]
C46  2.2 µF  [CAP 0805_2012]
C47  2.2 µF  [CAP 0805_2012]
C48  2.2 µF  [CAP 0805_2012]
C49  2.2 µF  [CAP 0805_2012]
D8  SMAJ24A  [FP-SMAJ-MFG]
J5  BM04B-GHS-TBT(LF)(SN)  [FP-BM04B-GHS-TBT_LF_SN-MFG]
L3  XGL4020-152MEC  value 1.5uH  [FP-XGL4020-MFG]
R23  1.1 Ohms  [RES 0603_1608]

### Nets
+24V: C44.2 C45.2 C46.2 C47.2 L3.1
CHASSIS: J5.5(MNT_1) J5.6(MNT_2)
GND: C46.1 C47.1 C48.1 C49.1 D8.2(A) J5.3 J5.4 R23.1
NetC44_1: C44.1 C45.1 R23.2
NetC48_2: C48.2 C49.2 D8.1(C) J5.1 J5.2 L3.2

### Notes on the sheet
- (near L3) 14.3 mOhm

### Library data of the parts
C44-C49 = CGA4J3X5R1H225K125AB: CAP CER 2.2UF 50V X5R 0805; manufacturer: TDK Corporation; Tolerance: ±10%; Part Number: CGA4J3X5R1H225K125AB; Capacitance: 2.2 µF; Applications: Automotive; componentlink1description: Datasheet; componentlink1url: https://product.tdk.com/info/en/catalog/datasheets/mlcc_automotive_general_en.pdf?ref_disty=digikey; componentlink2description: DigiKey Link; componentlink2url: https://www.digikey.com/en/products/detail/tdk-corporation/CGA4J3X5R1H225K125AB/2781306; Device Package: 0805 (2012 Metric); lastupdated: 2/9/2024 8:15:32 PM; Lifecycle Status: Active; Minimum Order: 1; Mounting Type: Surface Mount, MLCC; Operating Temperature: -55°C ~ 85°C; Package / Case: 0805 (2012 Metric); packaging: TapeAndReel; partid: 44302; Part Status: Active; price: 0.11; Ratings: AEC-Q200; series: CGA; Size / Dimension: 0.079" L x 0.049" W (2.00mm x 1.25mm); Supplier 1: DigiKey; Supplier Part Number 1: 445-7880-1-ND; Temperature Coefficient: X5R; Thickness (Max): 0.057" (1.45mm); value: 2.2 µF; Voltage - Rated: 50V
D8 = CMP-08607-000085-1: TVS DIODE 24V 38.9V DO214AC; Manufacturer: Littelfuse Inc; Direction: Unidirectional; Peak Pulse Power: 400W; Peak Pulse Current: 10.3A; Max Junction Temp: +150°C; Breakdown Voltage: 26.7V; Number Of Channels: 1; ComponentLink2Description: Datasheet; Device Class L3: unset; Height: 2.29mm; ComponentLink2URL: https://www.littelfuse.com/~/media/electronics/datasheets/tvs_diodes/littelfuse_tvs_diode_smaj_datasheet.pdf.pdf; Device Class L1: Circuit Protection; Package: SMAJ; Temperature Range High: +150°C; Device Class L2: TVS Diodes; Clamping Voltage: 38.9V; Reverse Standoff Voltage: 24V; Manufacturer Part Number: SMAJ24A; Mouser Description: In a Pack of 25, Littelfuse SMAJ24A, Uni-Directional TVS Diode, 400W, 2-Pin DO-214AC; Digikey Description: TVS DIODE 24V 38.9V DO214AC; Lead Free: Yes; Octopart: https://octopart.com/smaj24a-littelfuse-350003; Automotive: No; Temperature Range Low: -65°C; Category: Diode; RoHS: TRUE; Temperature: -65°C to +150°C
J5 = CMP-17439-000062-2: CONN HEADER SMD 4POS 1.25MM; Number of Positions: 4; Wire/Cable Gauge: 26AWG; Current Rating: 1A; Voltage Rating (AC): 50V; Gender: Male; Orientation: Straight; Max Operating Temperature: 85°C; Pitch: 1.25mm; Contact Plating: Tin; Number of Rows: 4; Series: GH; Min Operating Temperature: -25°C; REACH SVHC: No SVHC; Packaging: Cut Tape; Lead Free: Lead Free; Voltage Rating: 50V; Contact Material: Bronze; Number of Contacts: 4; Termination: Crimp; Case/Package: SMD/SMT; Housing Color: Natural; Housing Material: Nylon
L3 = CMP-11268-000020-1: Shielded Power Inductors; Manufacturer: Coilcraft; Saturation Current: 3.2A; Rms Current: 11.1A; Standoff Height: 0.12mm; Self Resonant Frequency: 45MHz; Series Resistance: 14.3mΩ; Test Frequency: 1MHz; Automotive Grade: Grade 1; Tolerance: 20%; Shielding: true; Core Material: Wirewound; ComponentLink2Description: Datasheet; Device Class L3: Fixed Inductors; Category: Ind; Device Class L2: Inductors; Inductance: 1.5uH; Package: XGL4020; Automotive: Yes; Ambient Temperature Range Low: -40°C; Manufacturer Part Number: XGL4020-152MEC; ComponentLink2URL: https://www.coilcraft.com/pdfs/xgl4020.pdf; Lead Free: Yes; RoHS: TRUE; Height: 2.1mm; Device Class L1: Passive Components; Composition: Composite; Ambient Temperature Range High: +125°C; Octopart: https://octopart.com/xgl4020-152mec-coilcraft-99681026
R23 = SR731JRTTD1R10F: RES 1.1 OHM 1% 1/5W 0603; Manufacturer: KOA Speer Electronics, Inc.; Power (Watts): 0.2W, 1/5W; Temperature Coefficient: ±200ppm/°C; Part Number: SR731JRTTD1R10F; Value: 1.1 Ohms; ComponentLink1Description: Datasheet; ComponentLink1URL: https://www.koaspeer.com/pdfs/SR73-RT.pdf; ComponentLink2Description: DigiKey Link; ComponentLink2URL: https://www.digikey.com/en/products/detail/koa-speer-electronics-inc/SR731JRTTD1R10F/13426422; Composition: Thick Film; Device Package: 0603 (1608 Metric); Features: Anti-Sulfur, Automotive AEC-Q200, Current Sense, Moisture Resistant; Height - Seated (Max): 0.022" (0.55mm); LastUpdated: 2/9/2024 8:41:12 PM; Lifecycle Status: Active; Minimum Order: 1; Number of Terminations: 2; Operating Temperature: -55°C ~ 155°C; Package / Case: 0603 (1608 Metric); Packaging: TapeAndReel; PartId: 67152; Part Status: Active; Price: 0.09; Ratings: AEC-Q200; Resistance: 1.1 Ohms; Series: SR73-RT; Size / Dimension: 0.063" L x 0.031" W (1.60mm x 0.80mm); Supplier 1: DigiKey; Supplier Part Number 1: 2019-SR731JRTTD1R10FCT-ND; Supplier Device Package: 0603; Tolerance: ±1%

## Sheet CANConnector.SchDoc
size A; SheetNumber: 2; SheetTotal: 15
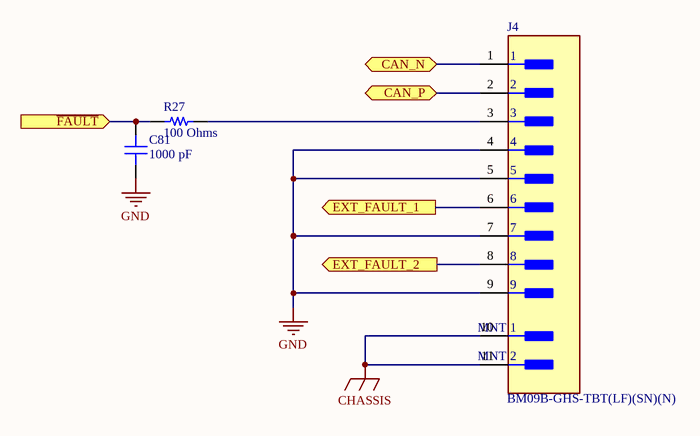
[diagram p8: CANConnector.SchDoc]

### Parts
(Parts that share a designator on the sheet are numbered #1, #2 ... from top to bottom, then left to right.)
C81  1000 pF  [CAP 0402_1005]
J4  BM09B-GHS-TBT(LF)(SN)(N)  [FP-BM09B-GHS-TBT_LF_SN-MFG]
R27#1  100 Ohms  [RES 0402_1005]

### Ports
CAN_N (bidir), CAN_P (bidir), EXT_FAULT_1 (out), EXT_FAULT_2 (out), ~{FAULT} (in)

### Nets
CHASSIS: J4.10(MNT_1) J4.11(MNT_2)
GND: C81.1 J4.4 J4.5 J4.7 J4.9
CAN_N: J4.1 ; port CAN_N
CAN_P: J4.2 ; port CAN_P
EXT_FAULT_1: J4.6 ; port EXT_FAULT_1
EXT_FAULT_2: J4.8 ; port EXT_FAULT_2
~{FAULT}: C81.2 R27#1.1 ; port ~{FAULT}
NetJ4_3: J4.3 R27#1.2

### Library data of the parts
C81 = UMK105CG102JVHF: CAP CER 1000PF 50V C0G/NP0 0402; manufacturer: Taiyo Yuden; Temperature Coefficient: C0G, NP0; Tolerance: ±5%; Part Number: UMK105CG102JVHF; Capacitance: 1000 pF; Applications: Automotive; componentlink1description: Datasheet; componentlink1url: https://ds.yuden.co.jp/TYCOMPAS/ut/detail?pn=UMK105CG102JVHF &u=M; componentlink2description: DigiKey Link; componentlink2url: https://www.digikey.com/en/products/detail/taiyo-yuden/UMK105CG102JVHF/4811103; Device Package: 0402 (1005 Metric); lastupdated: 2/9/2024 8:04:38 PM; Lifecycle Status: Active; Minimum Order: 1; Mounting Type: Surface Mount, MLCC; Operating Temperature: -55°C ~ 125°C; Package / Case: 0402 (1005 Metric); packaging: TapeAndReel; partid: 1779; Part Status: Active; price: 0.01; Ratings: AEC-Q200; series: M; Size / Dimension: 0.039" L x 0.020" W (1.00mm x 0.50mm); Supplier 1: DigiKey; Supplier Part Number 1: 587-3737-1-ND; Thickness (Max): 0.022" (0.55mm); value: 1000 pF; Voltage - Rated: 50V
J4 = CMP-17439-000449-1: CONN HEADER SMD 9POS 1.25MM
R27#1 = WR04X1000FTL: RES 100 OHM 1% 1/16W 0402; Manufacturer: Walsin Technology Corporation; Power (Watts): 0.063W, 1/16W; Temperature Coefficient: ±100ppm/°C; Part Number: WR04X1000FTL; Value: 100 Ohms; ComponentLink1Description: Datasheet; ComponentLink1URL: https://www.passivecomponent.com/wp-content/uploads/chipR/ASC_WR.pdf; ComponentLink2Description: DigiKey Link; ComponentLink2URL: https://www.digikey.com/en/products/detail/walsin-technology-corporation/WR04X1000FTL/13241075; Composition: Thick Film; Device Package: 0402 (1005 Metric); Height - Seated (Max): 0.016" (0.40mm); LastUpdated: 2/9/2024 8:28:55 PM; Lifecycle Status: Active; Minimum Order: 1; Number of Terminations: 2; Operating Temperature: -55°C ~ 155°C; Package / Case: 0402 (1005 Metric); Packaging: CutTape; PartId: 64787; Part Status: Active; Price: 0.01; Resistance: 100 Ohms; Series: WR; Size / Dimension: 0.039" L x 0.020" W (1.00mm x 0.50mm); Supplier 1: DigiKey; Supplier Part Number 1: 1292-WR04X1000FTLCT-ND; Supplier Device Package: 0402; Tolerance: ±1%

## Sheet MotorConnector.SchDoc
size A; SheetNumber: 10; SheetTotal: 15
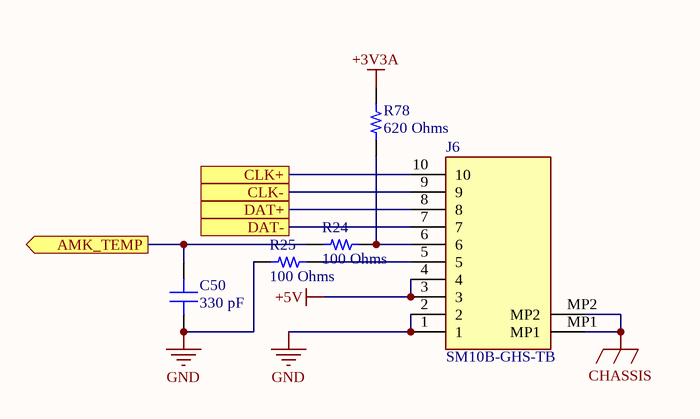
[diagram p9: MotorConnector.SchDoc]

### Parts
C50  330 pF  [CAP 0402_1005]
J6  SM10B-GHS-TB  [SM10BGHSTB]
R24  100 Ohms  [RES 0402_1005]
R25  100 Ohms  [RES 0402_1005]
R78  620 Ohms  [YAGEO RES 0402_1005]

### Ports
AMK_TEMP (out), CLK+, CLK-, DAT+, DAT-

### Nets
+3V3A: R78.2
+5V: J6.3 J6.4
CHASSIS: J6.MP1 J6.MP2
GND: C50.1 J6.1 J6.2 R25.1
CLK+: J6.10 ; port CLK+
CLK-: J6.9 ; port CLK-
DAT+: J6.8 ; port DAT+
DAT-: J6.7 ; port DAT-
M_TEMP: C50.2 R24.1 ; port AMK_TEMP
NetJ6_5: J6.5 R25.2
NetJ6_6: J6.6 R24.2 R78.1

### Library data of the parts
C50 = HMK105B7331MV-F: CAP CER 330PF 100V X7R 0402; manufacturer: Taiyo Yuden; Tolerance: ±20%; Part Number: HMK105B7331MV-F; Capacitance: 330 pF; Applications: SMPS Filtering; componentlink1description: Datasheet; componentlink1url: http://www.yuden.co.jp/productdata/catalog/mlcc06_e.pdf; componentlink2description: DigiKey Link; componentlink2url: https://www.digikey.com/en/products/detail/taiyo-yuden/HMK105B7331MV-F/6563581; Device Package: 0402 (1005 Metric); lastupdated: 2/9/2024 8:04:38 PM; Lifecycle Status: Active; Minimum Order: 1; Mounting Type: Surface Mount, MLCC; Operating Temperature: -55°C ~ 125°C; Package / Case: 0402 (1005 Metric); packaging: TapeAndReel; partid: 1855; Part Status: Active; price: 0.03; series: M; Size / Dimension: 0.039" L x 0.020" W (1.00mm x 0.50mm); Supplier 1: DigiKey; Supplier Part Number 1: 587-4988-1-ND; Temperature Coefficient: X7R; Thickness (Max): 0.022" (0.55mm); value: 330 pF; Voltage - Rated: 100V
J6 = SM10B-GHS-TB: Connector; Manufacturer_Name: 3D SYSTEMS; Datasheet Link: https://4donline.ihs.com/images/VipMasterIC/IC/JSTM/JSTMS02184/JSTMS02184-1.pdf?hkey=EF798316E3902B6ED9A73243A3159BB0; Height: 4.25mm; Manufacturer_Part_Number: SM10B-GHS-TB
R24 R25 = WR04X1000FTL: as R27#1 on sheet CANConnector; Part Number: WR04X1000FTL; Value: 100 Ohms; ComponentLink1Description: Datasheet; ComponentLink1URL: https://www.passivecomponent.com/wp-content/uploads/chipR/ASC_WR.pdf; ComponentLink2Description: DigiKey Link; ComponentLink2URL: https://www.digikey.com/en/products/detail/walsin-technology-corporation/WR04X1000FTL/13241075; Composition: Thick Film; Device Package: 0402 (1005 Metric); Height - Seated (Max): 0.016" (0.40mm); LastUpdated: 2/9/2024 8:28:55 PM; Lifecycle Status: Active; Minimum Order: 1; Number of Terminations: 2; Operating Temperature: -55°C ~ 155°C; Package / Case: 0402 (1005 Metric); Packaging: CutTape; PartId: 64787; Part Status: Active; Price: 0.01; Resistance: 100 Ohms; Series: WR; Size / Dimension: 0.039" L x 0.020" W (1.00mm x 0.50mm); Supplier 1: DigiKey; Supplier Part Number 1: 1292-WR04X1000FTLCT-ND; Supplier Device Package: 0402; Tolerance: ±1%
R78 = RC0402JR-07620RL: RES 620 OHM 5% 1/16W 0402; Manufacturer: Yageo; Power (Watts): 0.063W, 1/16W; Temperature Coefficient: ±100ppm/°C; Part Number: RC0402JR-07620RL; Value: 620 Ohms; ComponentLink1Description: Datasheet; ComponentLink1URL: https://www.yageo.com/upload/media/product/productsearch/datasheet/rchip/PYu-RC_Group_51_RoHS_L_10.pdf; ComponentLink2Description: DigiKey Link; ComponentLink2URL: https://www.digikey.com/en/products/detail/yageo/RC0402JR-07620RL/726498; Composition: Thick Film; Device Package: 0402 (1005 Metric); Features: Moisture Resistant; Height - Seated (Max): 0.016" (0.40mm); LastUpdated: 8/31/2025 3:04:15 PM; Lifecycle Status: Active; Minimum Order: 1; Number of Terminations: 2; Operating Temperature: -55°C ~ 155°C; Package / Case: 0402 (1005 Metric); Packaging: CutTape; PartId: 4894; Part Status: Active; Price: 0.01; Resistance: 620 Ohms; Series: RC_L; Size / Dimension: 0.039" L x 0.020" W (1.00mm x 0.50mm); Supplier 1: DigiKey; Supplier Part Number 1: 311-620JRCT-ND; Supplier Device Package: 0402; Tolerance: ±5%